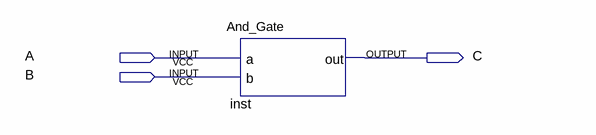
[diagram p0: schematic sheet]
// Quartus schematic And_Gate_Block.bdf as structural Verilog: 1 symbols, 3 pins
module And_Gate_Block (
  input  A,
  input  B,
  output C
);

  And_Gate inst (.a(A), .b(B), .out(C));
endmodule
